# Altium schematic sheet Power Management.SchDoc: Power Management
size A4; DocumentNumber: 3; SheetNumber: 3; SheetTotal: 51
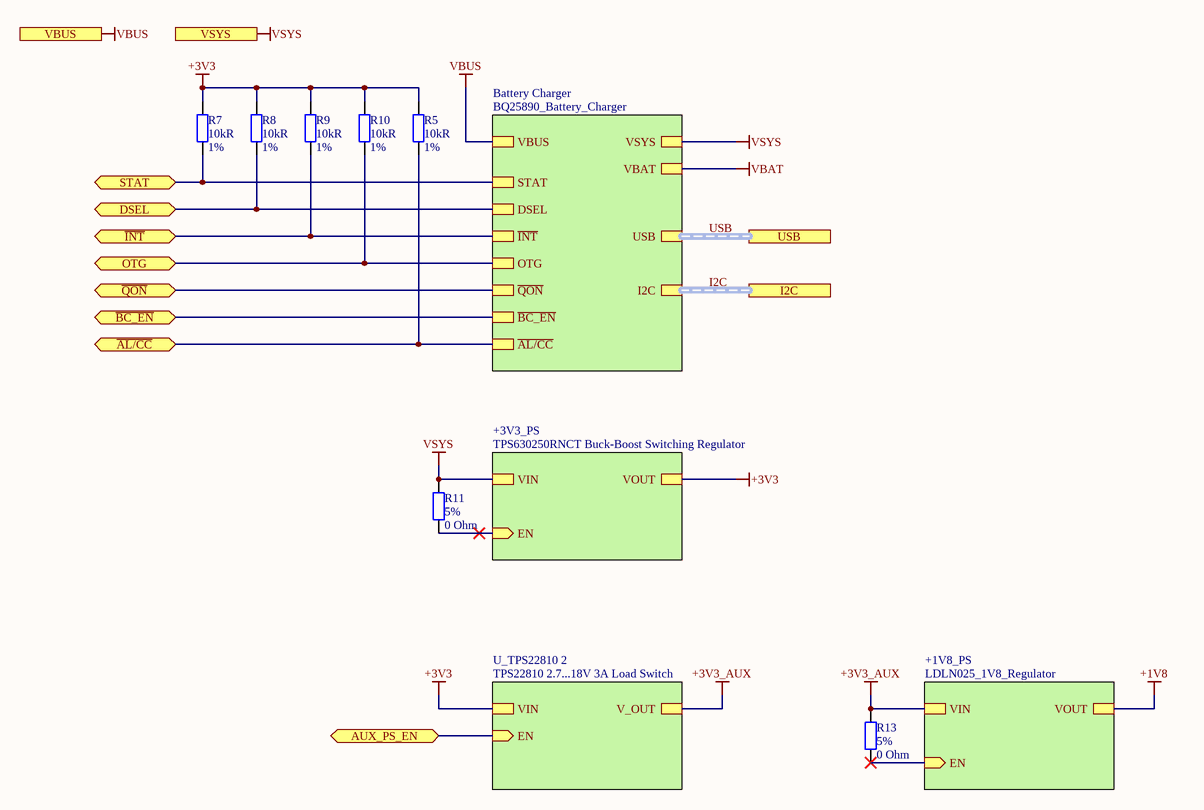
[diagram p0: Power Management.SchDoc]

## Parts
R5  Resistance: 10kR  Tolerance: 1%  [R0402]  (hidden comment: RES SMD 10K OHM 1% 1/16W 0402)
R7  Resistance: 10kR  Tolerance: 1%  [R0402]  (hidden comment: RES SMD 10K OHM 1% 1/16W 0402)
R8  Resistance: 10kR  Tolerance: 1%  [R0402]  (hidden comment: RES SMD 10K OHM 1% 1/16W 0402)
R9  Resistance: 10kR  Tolerance: 1%  [R0402]  (hidden comment: RES SMD 10K OHM 1% 1/16W 0402)
R10  Resistance: 10kR  Tolerance: 1%  [R0402]  (hidden comment: RES SMD 10K OHM 1% 1/16W 0402)
R11  Tolerance: 5%  Resistance: 0 Ohm  [R0402]  (hidden comment: RES SMD 0 OHM JUMPER 1/16W 0402)
R13  Tolerance: 5%  Resistance: 0 Ohm  [R0402]  (hidden comment: RES SMD 0 OHM JUMPER 1/16W 0402)

## Sub-sheets
+1V8_PS = LDLN025_1V8_Regulator: EN (in), VIN, VOUT
+3V3_PS = TPS630250RNCT Buck-Boost Switching Regulator: VOUT, VIN, EN (in)
Battery Charger = BQ25890_Battery_Charger: VSYS, VBUS, VBAT, STAT, DSEL, ~{INT}, OTG, ~{QON}, ~{BC_EN}, USB (harness USB), I2C (harness I2C), ~{AL/CC}
U_TPS22810 2 = TPS22810 2.7...18V 3A Load Switch: EN (in), V_OUT, VIN

## Ports
AUX_PS_EN (bidir), DSEL (bidir), I2C (harness I2C), OTG (bidir), STAT (bidir), USB (harness USB), VBUS, VSYS, ~{AL/CC} (bidir), ~{BC_EN} (bidir), ~{INT} (bidir), ~{QON} (bidir)

## Nets
+1V8: sheet +1V8_PS/VOUT
+3V3: R5.1 R7.1 R8.1 R9.1 R10.1 ; sheet +3V3_PS/VOUT, sheet U_TPS22810 2/VIN
+3V3_AUX: R13.2 ; sheet +1V8_PS/VIN, sheet U_TPS22810 2/V_OUT
VBAT: sheet Battery Charger/VBAT
VBUS: port VBUS, sheet Battery Charger/VBUS
VSYS: R11.2 ; port VSYS, sheet +3V3_PS/VIN, sheet Battery Charger/VSYS
~{AL/CC}: R5.2 ; port ~{AL/CC}, sheet Battery Charger/~{AL/CC}
~{BC_EN}: port ~{BC_EN}, sheet Battery Charger/~{BC_EN}
~{INT}: R9.2 ; port ~{INT}, sheet Battery Charger/~{INT}
~{QON}: port ~{QON}, sheet Battery Charger/~{QON}
AUX_PS_EN: port AUX_PS_EN, sheet U_TPS22810 2/EN
DSEL: R8.2 ; port DSEL, sheet Battery Charger/DSEL
OTG: R10.2 ; port OTG, sheet Battery Charger/OTG
STAT: R7.2 ; port STAT, sheet Battery Charger/STAT
NetR11_1: R11.1 ; sheet +3V3_PS/EN
NetR13_1: R13.1 ; sheet +1V8_PS/EN

## Buses and harness runs
harness I2C = port I2C = sheet Battery Charger/I2C
harness USB = port USB = sheet Battery Charger/USB

## Notes on the sheet
- Title
- Size:
- Date:
- A4
- Number:
- Time:
- Revision:
- Sheet
- of
- File:

## Library data of the parts
R5 R7-R10 = RES SMD 10K OHM 1% 1/16W 0402: 10 kOhms ±1% 0.063W, 1/16W Chip Resistor 0402 (1005 Metric) Moisture Resistant Thick Film; Manufacturer: Yageo; Manufacturer Part Number: RC0402FR-0710KP; Max Power Dissipation: 63mW; Temperature Coefficient: 150ppm/°C; Supplier 1: Digi-Key; Stock 1: 839368; Pricing 1: 1=0.1, 10=0.035, 100=0.014, 1000=0.0063, 2500=0.0055, 5000=0.0045 (USD); Case/Package: 0402; Case Code (Metric): 1005; Case Code (Imperial): 0402; Min Operating Temperature: -55°C; Max Operating Temperature: 155°C; Packaging: Tape and Reel; Composition: Thick Film; Number of Terminations: 2; Features: Moisture Resistant; Length: 0.039inch; Height: 0.016inch; Width: 0.02inch; ComponentLink1URL: http://www.yageo.com/NewPortal/yageodocoutput?fileName=/pdf/R-Chip/PYu-RC_51_RoHS_P_0.pdf&src-supplier=Digi-Key; ComponentLink1Description: http://www.yageo.com/NewPortal/yageodocoutput?fileName=/pdf/R-Chip/PYu-RC_51_RoHS_P_0.pdf&src-supplier=Digi-Key; Supplier Part Number 1: YAG1249CT-ND; Mount: Surface Mount
R11 R13 = RES SMD 0 OHM JUMPER 1/16W 0402: 0 Ohms Jumper 0.063W, 1/16W Chip Resistor 0402 (1005 Metric) Moisture Resistant Thick Film; Manufacturer: Yageo; Manufacturer Part Number: RC0402JR-070RL; Power Rating: 62.5mW; Voltage Rating: 50V; Max Power Dissipation: 63mW; Temperature Coefficient: 200ppm/°C; Supplier 1: Digi-Key; Stock 1: 46057148; Pricing 1: 1=0.1, 10=0.013, 25=0.0092, 50=0.0072, 100=0.0053, 250=0.004, 500=0.0032, 1000=0.0024, 5000=0.0017 (USD); Contact Plating: Tin,Matte; Case Code (Metric): 1005; Case Code (Imperial): 0402; Min Operating Temperature: -55°C; Max Operating Temperature: 155°C; Packaging: Tape and Reel; Composition: Thick Film; Package Quantity: 1; Number of Terminations: 2; Termination: SMD/SMT; Military Standard: Not; Features: Moisture Resistant; Length: 1mm; Height: 0.016inch; Width: 0.02inch; Depth: 0.5mm; Radiation Hardening: No; REACH SVHC: Unknown; Lead Free: Lead Free; ComponentLink1URL: http://www.yageo.com/documents/recent/PYu-RC_Group_51_RoHS_L_10.pdf?src-supplier=Digi-Key; ComponentLink1Description: http://www.yageo.com/documents/recent/PYu-RC_Group_51_RoHS_L_10.pdf?src-supplier=Digi-Key; ComponentLink2URL: http://www.yageo.com/documents/recent/PYu-RC0402_51_RoHS_L_6.pdf?src-supplier=Avnet+Europe; ComponentLink2Description: http://www.yageo.com/documents/recent/PYu-RC0402_51_RoHS_L_6.pdf?src-supplier=Avnet+Europe; ComponentLink3URL: http://www.farnell.com/datasheets/1018594.pdf?src-supplier=Element14; ComponentLink3Description: http://www.farnell.com/datasheets/1018594.pdf?src-supplier=Element14; ComponentLink4URL: https://www.verical.com/server-webapp/html/getDatasheet?partID=326379&src-supplier=Verical; ComponentLink4Description: https://www.verical.com/server-webapp/html/getDatasheet?partID=326379&src-supplier=Verical; ComponentLink5URL: http://www.farnell.com/datasheets/2167052.pdf?src-supplier=Element14; ComponentLink5Description: http://www.farnell.com/datasheets/2167052.pdf?src-supplier=Element14; Supplier Part Number 1: 311-0.0JRCT-ND; Case/Package: 0402; Mount: Surface Mount
  R11: ClassName: +3V3_PS
  R13: ClassName: +1V8_PS